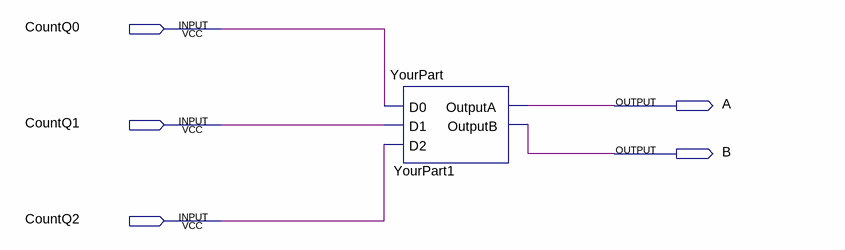
[diagram p0: schematic sheet]
// Quartus schematic BigPart.bdf as structural Verilog: 1 symbols, 5 pins
module BigPart (
  input  CountQ0,
  input  CountQ1,
  input  CountQ2,
  output A,
  output B
);

  YourPart YourPart1 (.D0(CountQ0), .D1(CountQ1), .D2(CountQ2), .OutputA(A), .OutputB(B));
endmodule
